# EAGLE design slush_cap_board_rev_e (EAGLE 8.5.0)
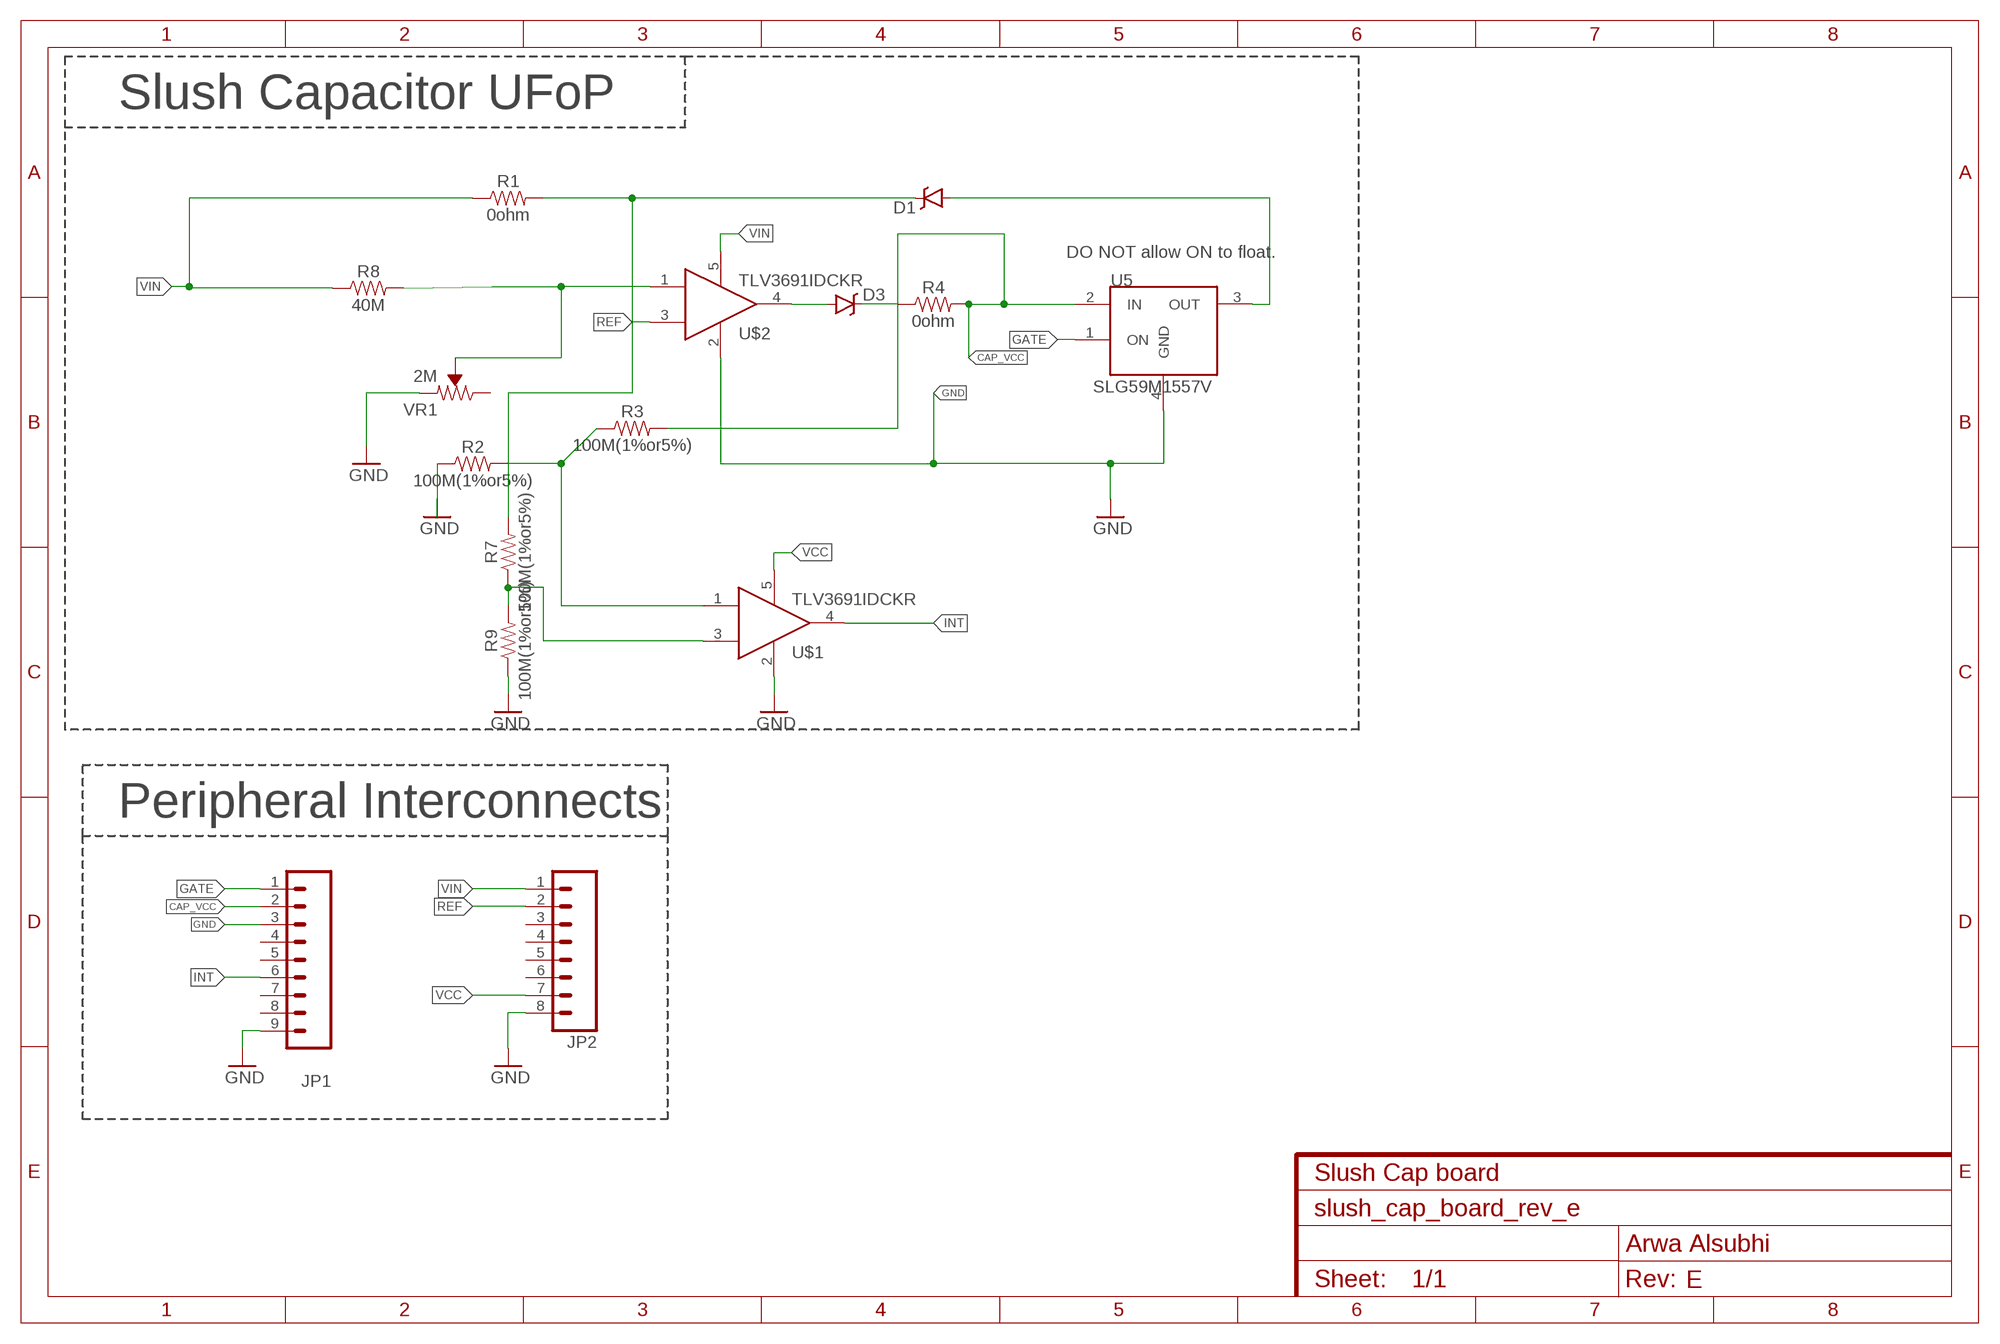
[diagram p0: schematic, sheet 1]
FRAME2 (FRAME-A4L): CNAME: Slush Cap board; CREVISION: E; DESIGNER: Arwa Alsubhi

## Parts
D1  RB751  DIODE-SCHOTTKY-RB751  [SOD-523]
D3  RB751  DIODE-SCHOTTKY-RB751  [SOD-523]
JP1  M091.27MM  [1X09-1.27MM]
JP2  M081.27MM  [1X08-1.27MM]
R1  0ohm  0603-RESISTOR-0603-1/10W-1%  [0603]
R2  100M(1%or5%)  0.3OHM-0805-1/8W-1%  [0805]
R3  100M(1%or5%)  0.3OHM-0805-1/8W-1%  [0805]
R4  0ohm  0603-RESISTOR-0603-1/10W-1%  [0603]
R7  100M(1%or5%)  0.3OHM-0805-1/8W-1%  [0805]
R8  40M  0.3OHM-0805-1/8W-1%  [0805]
R9  100M(1%or5%)  0.3OHM-0805-1/8W-1%  [0805]
U5  SLG59M1557V  [4STDFN]
U$1  TLV3691IDCKR  [SOT353]
U$2  TLV3691IDCKR  [SOT353]
VR1  2M  TRIMPOT-SMD-3MM-CLOSED-1/8W-20%  [TRIMPOT-SMD-3MM-CLOSED]

## Nets
CAP_VCC: JP1.2 R3.2 R4.2 U5.2(IN)
GATE: JP1.1 U5.1(ON)
GND: JP1.3 JP1.9 JP2.8 R2.1 R9.1 U5.4(GND) U$1.2 U$2.2 VR1.1(CCW)
INT: JP1.6 U$1.4
N$1: D3.A U$2.4
N$3: D1.A U5.3(OUT)
N$4: R8.2 U$2.1 VR1.2(WIPER)
N$6: D1.C R1.2 R7.2
N$7: R7.1 R9.2 U$1.3
N$8: R2.2 R3.1 U$1.1
N$9: D3.C R4.1
REF: JP2.2 U$2.3
VCC: JP2.7 U$1.5
VIN: JP2.1 R1.1 R8.1 U$2.5
Unconnected: JP1.4 JP1.5 JP1.7 JP1.8 JP2.3 JP2.4 JP2.5 JP2.6 VR1.3(CW)

## Notes on the sheet
- Slush Capacitor UFoP
- DO NOT allow ON to float.
- Peripheral Interconnects

## Library data of the parts
D1 D3 = SparkFun-DiscreteSemi:DIODE-SCHOTTKY: Schottky diodes in SFE's production catalog BAT20J 1A 23V 0.62Vf RB751 120mA 40V 0.37Vf PMEG4005EJ 0.5A 40V 0.42Vf MBRA140 1A 40V 0.5Vf B340A 3A 40V SMA; DIGIKEY: BAS40-02V-V-G-08GICT-ND; MPN: BAS40-02V-V-G-08; PROD_ID: DIO-11018
JP1 = SparkFun-Connectors:M09: Header 9 Standard 9-pin 0.1" header. Use with straight break away headers (SKU : PRT-00116), right angle break away headers (PRT-00553), swiss pins (PRT-00743), machine pins (PRT-00117), and female headers (PRT-00115).; DIGIKEY: S9014E-09-ND; MANUFACTURERPARTNUMBER: GRPB091VWVN-RC; MPN: GRPB091VWVN-RC
JP2 = SparkFun-Connectors:M08: Header 8 Standard 8-pin 0.1" header. Use with straight break away headers (SKU : PRT-00116), right angle break away headers (PRT-00553), swiss pins (PRT-00743), machine pins (PRT-00117), and female headers (PRT-00115).; DIGIKEY: S9014E-08-ND; MANUFACTURERPARTNUMBER: GRPB081VWVN-RC; MPN: GRPB081VWVN-RC
R1 R4 = Arwa_lib:0603-RESISTOR: resistor A resistor is a passive two-terminal electrical component that implements electrical resistance as a circuit element. Resistors act to reduce current flow, and, at the same time, act to lower voltage levels within circuits. - Wikipedia; PROD_ID: RES-08787
R2 R3 R7-R9 = SparkFun-Resistors:0.3OHM: 0.3Ω resistor A resistor is a passive two-terminal electrical component that implements electrical resistance as a circuit element. Resistors act to reduce current flow, and, at the same time, act to lower voltage levels within circuits. - Wikipedia; PROD_ID: RES-11622; VALUE: 0.3
U5 = loadswitches:SLG59M1557V: SILEGO SLG59M1557V: Ultra-small 28.5 mΩ, 1.0 A Integrated Power Switch with Discharge The SLG59M1557V is designed for load switching applications with ultra low quiescent current (20nA), and low turn on voltage (0.85V). The part comes with one 28.5 mΩ 1.0 A rated P-channel MOSFET controlled by a single ON control pin. The product is packaged in an ultra-small 1.0 x 1.0 mm package.; MANAFACTURER: SLG59M1557V; MOUSER: 402-SLG59M1557V; MPN: SLG59M1557V
U$1 U$2 = Arwa_lib:TLV3691IDCKR
VR1 = SparkFun-Resistors:TRIMPOT: Trimming Potentiometer (Trimpot) Three-terminal potentiometers, with an adjustable wiper and two adjustable resistors. A pot can be used to create a configurable voltage divider, or as a variable resistor. "Trimpots" are a subset of potentiometers, usually intended for "set-and-forget" applications. They're often more delicate than standard potentiometers - rated for fewer turns. Variants PTH-KNOB - PTH Trimpot w/ finger-adjustable knob Trimpot 10K with Knob <https://www.sparkfun.com/products/9806> (COM-09806) Datasheet <http://www.sparkfun.com/datasheets/Components/General/TSR-3386.pdf> SMD-3MM-CLOSED-FRAME - SMD 3mm Square Closed-Frame Trimpot Used on e.g. EasyDriver - Stepper Motor Driver <https://www.sparkfun.com/products/12779> Datasheet <http://www.bitechnologies.com/pdfs/22.pdf> (22AR10KTR) SMD-5MM - SMD 5mm Square Closed-Frame Trimpot Used on e.g. IOIO-OTG - V2.2 <https://www.sparkfun.com/products/13613> Datasheet <http://www.vishay.com/docs/51008/ts53.pdf> (TS53YL502MR10) SMD-3MM-1/10W-25% - 3mm Square Open-Frame Trimpot Used on e.g. SparkFun Shapeoko <https://www.sparkfun.com/products/13899> Datasheet <http://www.bourns.com/docs/Product-Datasheets/TC33.pdf> (TC33X-2-103E); PROD_ID: RES-09285; VALUE: 10k

## Board
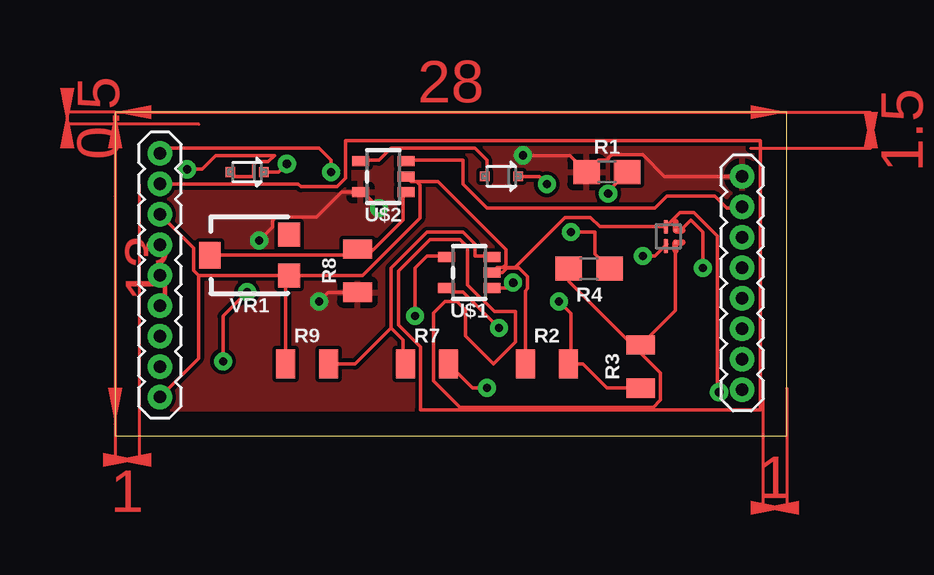
[diagram p1: board, top side]
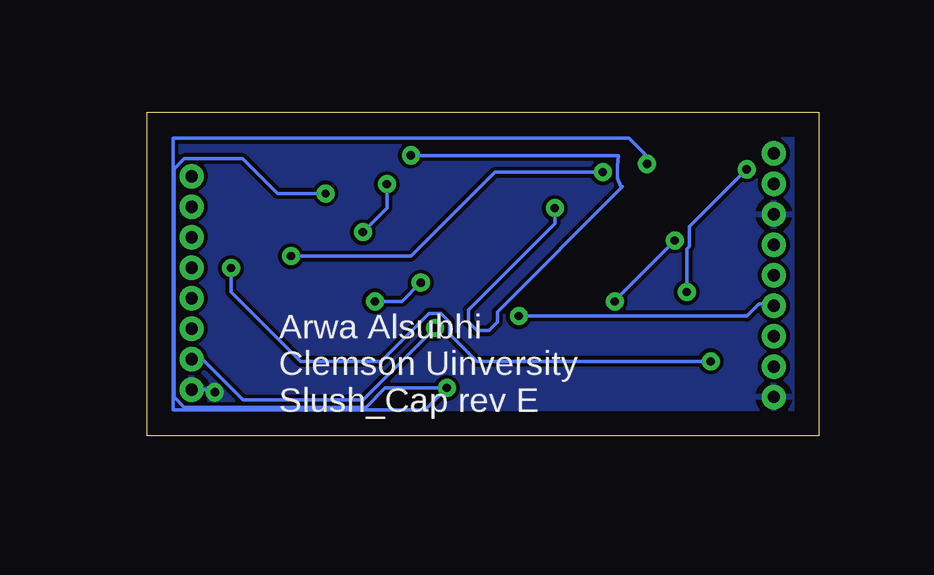
[diagram p2: board, bottom side, seen from below]

Size 28 x 13.5 mm. Coordinates in mm from the lower left corner, seen from the top.
Outline: 0,0 28,0 28,13.5 0,13.5 0,0
Copper layers (1*16): Top 0.035mm / dielectric 1.5mm / Bottom 0.035mm
Design rules "default": minimum track width 6mil, minimum drill 0.35mm, track to track 6mil, track to pad 6mil, pad to pad 6mil, via to via 6mil, smd to smd 6mil, copper to edge 40mil, drill to drill 6mil, minimum pad ring 10mil, minimum via ring 8mil, stop-mask expansion 4mil, vias tented up to drill 0mil, thermal gap 10mil

### Footprints (pad centres in the part's own frame; a part is rotated, then mirrored left to right if it is on the bottom)
SOD-523 = smd 0.4 x 0.4: A -0.7,0; C 0.7,0
1X09-1.27MM = drill 0.508 pad 1: 1 0,0; 2 1.27,0; 3 2.54,0; 4 3.81,0; 5 5.08,0; 6 6.35,0; 7 7.62,0; 8 8.89,0; 9 10.16,0
1X08-1.27MM = drill 0.508 pad 1: 1 0,0; 2 1.27,0; 3 2.54,0; 4 3.81,0; 5 5.08,0; 6 6.35,0; 7 7.62,0; 8 8.89,0
0603 = smd 1.1 x 1: 1 -0.85,0; 2 0.85,0
0805 = smd 0.8 x 1.2: 1 -0.9,0; 2 0.9,0
4STDFN = smd 0.6 x 0.2: 1 -0.4,0.1; 4 0.4,0.1 | smd 0.152 x 0.152: 2 -0.25,-0.3; 3 0.25,-0.3
SOT353 = smd 0.42 x 0.7: 1 -0.65,-0.95; 2 0,-0.95; 3 0.65,-0.95; 4 0.65,0.95; 5 -0.65,0.95
TRIMPOT-SMD-3MM-CLOSED = smd 1 x 0.9: 1 -0.85,-1.65; 3 0.85,-1.65 | smd 1.1 x 0.9: 2 0,1.65

### Placement (x,y rotation side)
D1  5.5,11 0 top
D3  16.1,10.82 0 top
JP1  1.87,11.78 270 top
JP2  26.14,10.82 270 top
R1  20.5,11 0 top
R2  18,3 0 top
R3  21.91,2.89 90 top
R4  19.76,6.97 180 top
R7  13,3 0 top
R8  10.1,6.89 90 top
R9  8,3 0 top
U5  23.06,8.32 90 top
U$1  14.76,6.81 90 top
U$2  11.18,10.81 90 top
VR1  5.6,7.54 90 top

### Tracks (layer width: path | path; a pad name or v marks a point on that pad's centre or on a via)
CAP_VCC
  Top 0.152: R4.2 18.91,6.45 21.93,3.43 | 21.93,3.43 22.74,2.62 22.74,1.5 22.44,1.2 14.37,1.2 13.27,2.3 13.27,5.13 13.75,5.61 14.25,5.61 14.61,5.25 14.61,4.17 15.78,3 16.7,3.92 16.7,5.18 15.81,5.18 14.7,6.29 14.7,7.87 14.37,8.2 13.13,8.2 11.8,6.87 11.8,4.63 12.73,3.7 12.73,1.09 26.91,1.09 26.91,12.3 9.61,12.3 9.61,10.75 9.25,10.39 7.75,10.39 7.63,10.51 JP1.2 | U5.2 23.36,5.24 R3.2 21.93,3.77 21.93,3.43
GATE  (via drill 0.35)
  Top 0.152: v9,11 9,11.5 8.5,12 2,12 JP1.1 | v22,7.5 22.5,7.5 23,8 U5.1
  Bottom 0.152: v9,11 13.5,11 17,7.5 v22,7.5
GND  (via drill 0.35)
  Top 0.152: JP1.3 3.27,7.84 3.27,6.89 3.48,6.69 | VR1.1 3.48,6.69 | 16.16,7.02 16.66,7.02 18.75,9.11 19.82,9.11 20.21,8.72 U5.4 23.55,9.3 24.13,9.3 25.11,8.32 25.11,1.89 v25.18,1.82 | R2.1 17.1,6.04 17.2,6.14 17.2,6.64 16.84,7 16.34,7 16.15,6.81 U$1.2 15.92,7.02 16.16,7.02 | 16.16,7.02 16.29,7.16 16.29,7.76 13.46,10.6 12.57,10.6 | 12.57,10.6 12.71,10.46 12.71,9.07 10.32,6.69 VR1.1 | U$2.2 12.34,10.6 12.57,10.6 | VR1.1 7.1,6.54 R9.1 | 3.48,6.69 3.48,3.23 JP1.9
  Bottom 0.152: JP2.8 25.29,1.93 v25.18,1.82
  pour Bottom: 0,14 28,14 28,0 0,0
INT  (via drill 0.35)
  Top 0.152: v12.5,5 12.5,7 13,7.5 13.5,7.5 U$1.4
  Bottom 0.152: v12.5,5 3,5 2.5,5.5 2,5.5 JP1.6
N$1
  Top 0.152: U$2.4 10.5,11.5 11,11.5 11.5,12 15,12 15.5,11.5 15.5,11 D3.A
N$3  (via drill 0.35)
  Top 0.152: D1.A 4.99,10.81 5.77,10.81 5.77,11.29 5.91,11.43 6.38,11.43 6.65,11.7 4.2,11.7 3.62,11.12 v3,11.12 | v5.5,6 4.5,5 v4.5,3.11 | v24.5,7 24.5,8.5 24,9 23.57,8.57 U5.3
  Bottom 0.152: v5.5,6 5.5,7.79 5.39,7.89 5.39,8.72 v3,11.12 | v4.5,3.11 14.25,3.11 15.39,4.25 15.39,4.75 15.75,5.11 16.25,5.11 18.25,3.11 21.61,3.11 24.5,6 v24.5,7
N$4
  Top 0.152: U$2.1 12,10 12,9 10.5,7.5 R8.2 9.85,7.54 VR1.2
N$6  (via drill 0.35)
  Top 0.152: R1.2 20.56,10.21 v20.56,10.11 | R7.2 14.9,2 v15.5,2 | v7.16,11.34 6.82,11 D1.C
  Bottom 0.152: v20.56,10.11 22.56,10.11 24.01,11.56 26.45,11.56 26.88,11.12 26.88,1.62 26.45,1.19 18.88,1.19 18.07,2 v15.5,2 16.41,1.09 26.91,1.09 26.91,12.41 7.91,12.41 7,11.5 v7.16,11.34
N$7
  Top 0.152: U$1.3 15.5,7.5 15,7.5 15,8 14.5,8.5 13,8.5 11.5,7 11.5,4.5 | 11.5,4.5 12,4 12,3 R7.1 | R9.2 10,3 11.5,4.5
N$8  (via drill 0.35)
  Top 0.152: 19,3 19.5,3 20.5,2 21.5,2 R3.1 | 19,3 R2.2 | U$1.1 16.36,6.16 v16.59,6.39 | v18.5,5.61 19,5.11 19,3
  Bottom 0.152: v16.59,6.39 17.38,5.61 v18.5,5.61
N$9  (via drill 0.35)
  Top 0.152: 20.5,7 R4.1 20,7.58 20,8.5 v19,8.5 | v18,10.5 17.68,10.82 D3.C
  Bottom 0.152: v19,8.5 18,9.5 v18,10.5
REF
  Top 0.152: U$2.3 12,11.5 14.5,11.5 14.5,10.5 15.5,9.5 22.5,9.5 23,10 25,10 25.5,9.5 26,9.5 JP2.2
VCC  (via drill 0.35)
  Top 0.152: v16,4.5 14.5,6 14,6 U$1.5
  Bottom 0.152: v16,4.5 19,1.5 24,1.5 26,3.5 JP2.7
VIN  (via drill 0.35)
  Top 0.152: R8.1 8.88,5.99 v8.5,5.61 | v6,8.15 6.57,8.72 6.57,8.98 6.71,9.12 8.41,9.12 9.45,10.16 U$2.5 10.34,10.16 v11,9.5 | v17,11.7 18.95,11.7 R1.1 20.15,11.5 20.5,11.5 20.57,11.57 20.57,11.6 20.7,11.73 22,11.73 22.9,10.82 JP2.1
  Bottom 0.152: v6,8.15 8.5,5.65 v8.5,5.61 | v11,9.5 11,8.86 14.61,5.25 14.61,4.75 14.25,4.39 13.75,4.39 13.39,4.75 13.39,5.18 8.18,10.39 8.25,10.39 8.39,10.75 8.39,11.25 8.34,11.7 v17,11.7
  pour Top: 0,14 28,14 28,-0.5 0,-0.5
(copper drawn outside any net)
  shapes: Top area x6

### Text on the board
bNames: Arwa Alsubhi / Clemson Uinversity / Slush_Cap rev E